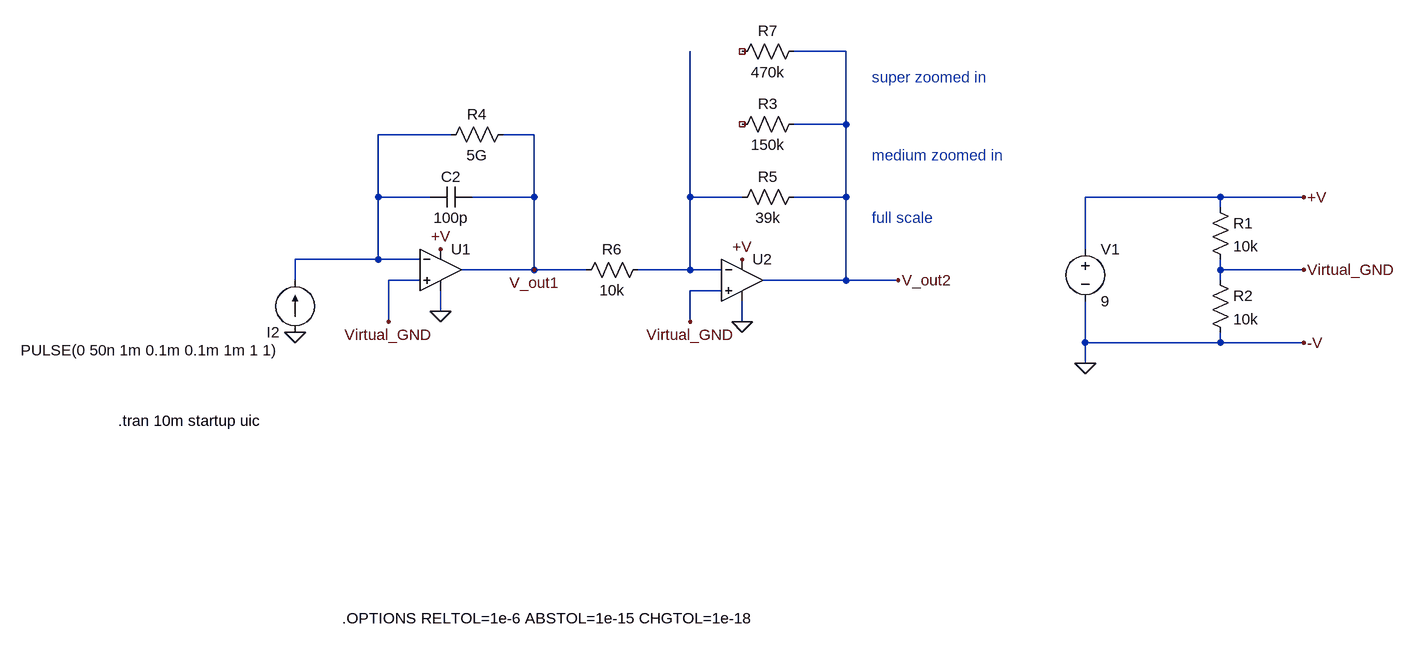
[diagram p0: schematic ECE412_5Gohm_10k_30k.asc]
ECE412_5Gohm_10k_30k.asc, the LTspice schematic file:
Version 4
SHEET 1 2856 3492
WIRE 1920 -208 1840 -208
WIRE 1920 -96 1920 -208
WIRE 1920 -96 1840 -96
WIRE 1312 -80 1200 -80
WIRE 1440 -80 1392 -80
WIRE 1200 16 1200 -80
WIRE 1280 16 1200 16
WIRE 1440 16 1440 -80
WIRE 1440 16 1344 16
WIRE 1680 16 1680 -208
WIRE 1760 16 1680 16
WIRE 1920 16 1920 -96
WIRE 1920 16 1840 16
WIRE 2496 16 2288 16
WIRE 2624 16 2496 16
WIRE 2496 32 2496 16
WIRE 2288 96 2288 16
WIRE 1200 112 1200 16
WIRE 1200 112 1072 112
WIRE 1264 112 1200 112
WIRE 1440 128 1440 16
WIRE 1440 128 1328 128
WIRE 1520 128 1440 128
WIRE 1680 128 1680 16
WIRE 1680 128 1600 128
WIRE 1728 128 1680 128
WIRE 2496 128 2496 112
WIRE 2624 128 2496 128
WIRE 1072 144 1072 112
WIRE 1264 144 1216 144
WIRE 1920 144 1920 16
WIRE 1920 144 1792 144
WIRE 2000 144 1920 144
WIRE 2496 144 2496 128
WIRE 1728 160 1680 160
WIRE 1296 192 1296 160
WIRE 1216 208 1216 144
WIRE 1680 208 1680 160
WIRE 1760 208 1760 176
WIRE 2288 240 2288 176
WIRE 2496 240 2496 224
WIRE 2496 240 2288 240
WIRE 2624 240 2496 240
WIRE 2288 272 2288 240
FLAG 2624 16 +V
FLAG 2624 240 -V
FLAG 2288 272 0
FLAG 1296 192 0
FLAG 1760 208 0
FLAG 1072 224 0
FLAG 1440 128 V_out1
FLAG 2000 144 V_out2
FLAG 1216 208 Virtual_GND
FLAG 1680 208 Virtual_GND
FLAG 1296 96 +V
FLAG 1760 112 +V
FLAG 2624 128 Virtual_GND
SYMBOL voltage 2288 80 R0
WINDOW 123 0 0 Left 0
WINDOW 39 0 0 Left 0
SYMATTR InstName V1
SYMATTR Value 9
SYMBOL current 1072 224 R180
WINDOW 123 24 52 Left 2
WINDOW 39 0 0 Left 0
WINDOW 3 24 -28 Left 2
SYMATTR Value PULSE(0 50n 1m 0.1m 0.1m 1m 1 1)
SYMATTR InstName I2
SYMBOL res 1408 -96 R90
WINDOW 0 0 56 VBottom 2
WINDOW 3 32 56 VTop 2
SYMATTR InstName R4
SYMATTR Value 5G
SYMBOL res 1856 0 R90
WINDOW 0 0 56 VBottom 2
WINDOW 3 32 56 VTop 2
SYMATTR InstName R5
SYMATTR Value 39k
SYMBOL res 1616 112 R90
WINDOW 0 0 56 VBottom 2
WINDOW 3 32 56 VTop 2
SYMATTR InstName R6
SYMATTR Value 10k
SYMBOL cap 1344 0 R90
WINDOW 0 0 32 VBottom 2
WINDOW 3 32 32 VTop 2
SYMATTR InstName C2
SYMATTR Value 100p
SYMBOL OpAmps\\UniversalOpAmp2 1296 128 R0
SYMATTR InstName U1
SYMBOL OpAmps\\UniversalOpAmp2 1760 144 R0
SYMATTR InstName U2
SYMBOL res 2480 16 R0
SYMATTR InstName R1
SYMATTR Value 10k
SYMBOL res 2480 128 R0
SYMATTR InstName R2
SYMATTR Value 10k
SYMBOL res 1856 -112 R90
WINDOW 0 0 56 VBottom 2
WINDOW 3 32 56 VTop 2
SYMATTR InstName R3
SYMATTR Value 150k
SYMBOL res 1856 -224 R90
WINDOW 0 0 56 VBottom 2
WINDOW 3 32 56 VTop 2
SYMATTR InstName R7
SYMATTR Value 470k
TEXT 800 360 Left 2 !.tran 10m startup uic
TEXT 1144 664 Left 2 !.OPTIONS RELTOL=1e-6 ABSTOL=1e-15 CHGTOL=1e-18
TEXT 1960 48 Left 2 ;full scale
TEXT 1960 -48 Left 2 ;medium zoomed in
TEXT 1960 -168 Left 2 ;super zoomed in

The netlist it stands for:
* ECE412_5Gohm_10k_30k.asc
V1 +V 0 9
I2 0 N001 PULSE(0 50n 1m 0.1m 0.1m 1m 1 1)
R4 V_out1 N001 5G
R5 V_out2 N002 39k
R6 N002 V_out1 10k
C2 V_out1 N001 100p
XU1 Virtual_GND N001 +V 0 V_out1 level2 Avol=1Meg GBW=10Meg Slew=10Meg Ilimit=25m Rail=0 Vos=0 En=0 Enk=0 In=0 Ink=0 Rin=500Meg  ; pins In+ In- V+ V- OUT
XU2 Virtual_GND N002 +V 0 V_out2 level2 Avol=1Meg GBW=10Meg Slew=10Meg Ilimit=25m Rail=0 Vos=0 En=0 Enk=0 In=0 Ink=0 Rin=500Meg  ; pins In+ In- V+ V- OUT
R1 +V Virtual_GND 10k
R2 Virtual_GND 0 10k
R3 V_out2 NC_01 150k
R7 V_out2 NC_02 470k
.tran 10m startup uic
.OPTIONS RELTOL=1e-6 ABSTOL=1e-15 CHGTOL=1e-18
* full scale
* medium zoomed in
* super zoomed in
.lib UniversalOpAmp2.lib
.backanno
.end

* Results of the author's LTspice run, read from the files saved beside the schematic
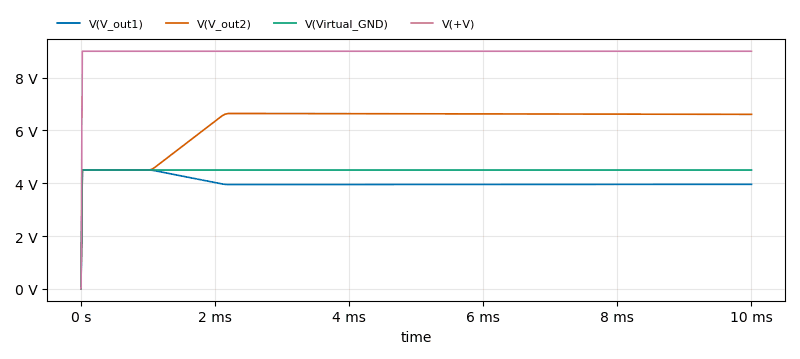
[diagram p1: Transient Analysis of ECE412_5Gohm_10k_30k.asc, plotted from the saved traces]
* Transient Analysis, 1 run:
*   V(V_out1): min 0 V, max 4.5 V, average 4.037 V, rms 4.044 V, last 3.959 V
*   V(V_out2): min 0 V, max 6.642 V, average 6.282 V, rms 6.328 V, last 6.609 V
*   V(Virtual_GND): min 0 V, max 4.5 V, average 4.495 V, rms 4.498 V, last 4.5 V
*   V(+V): min 0 V, max 9 V, average 8.991 V, rms 8.995 V, last 9 V